# EAGLE design Syn-MainBase-v00 (EAGLE 5.10)
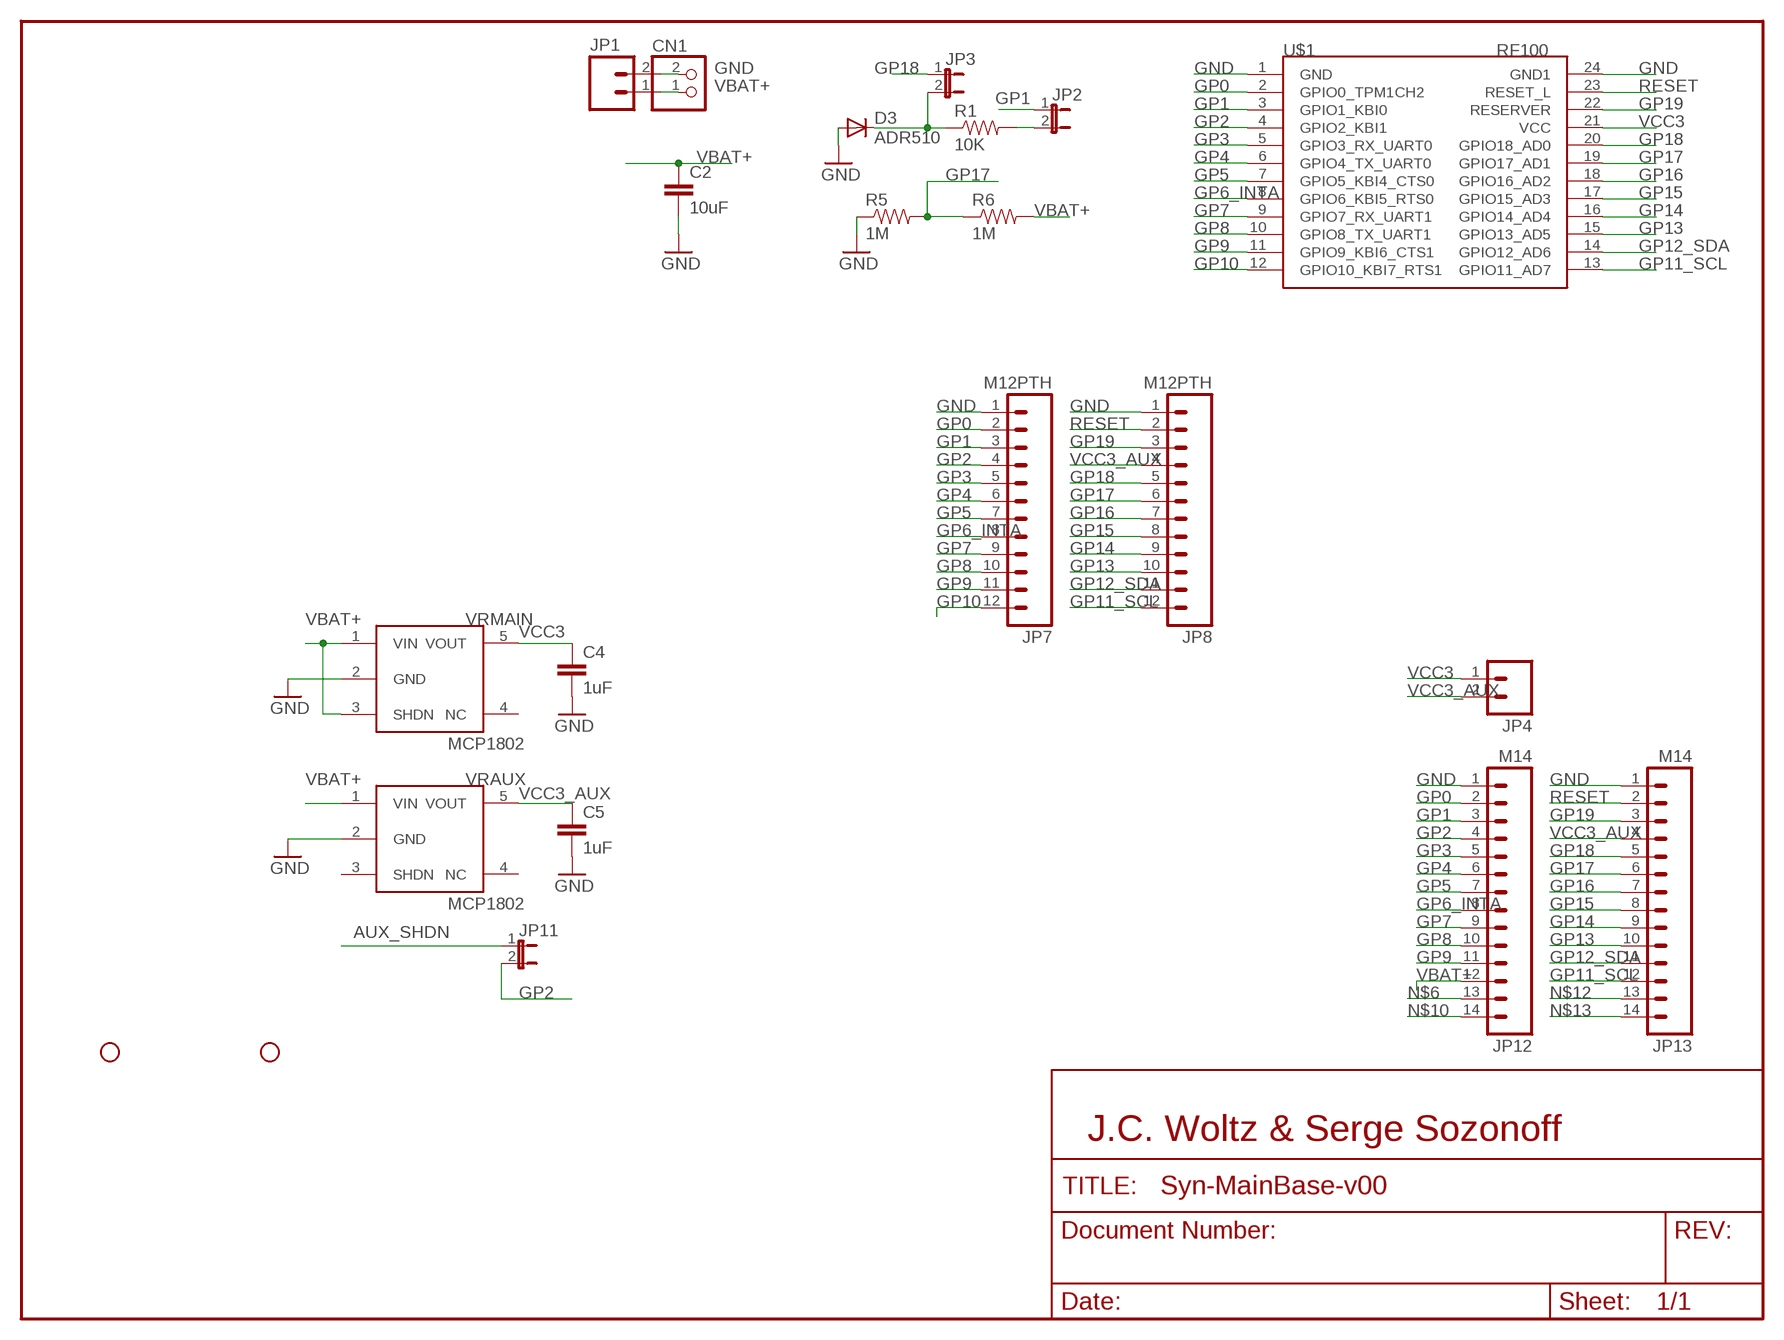
[diagram p0: schematic, sheet 1]

## Parts
C2  10uF  CAP1206  [1206]
C4  1uF  CAP0603-CAP  [0603-CAP]
C5  1uF  CAP0603-CAP  [0603-CAP]
CN1  JST_2PIN-THM-RA  [JST-PH-2-THM-RA]
D3  ADR510  DIODESOT-23-3-ADR510  [SOT23-3]
JP1  M02PTH  [1X02]
JP2  JUMPER-2SMD-NC  [SJ_2S]
JP3  JUMPER-2SMD-NC  [SJ_2S]
JP4  M02PTH  [1X02]
JP5  STAND-OFF  [STAND-OFF]
JP7  M12PTH  [1X12]
JP8  M12PTH  [1X12]
JP11  JUMPER-2SMD-NC  [SJ_2S]
JP12  M14  [1X14]
JP13  M14  [1X14]
JP17  STAND-OFF  [STAND-OFF]
R1  10K  RESISTOR0603-RES  [0603-RES]
R5  1M  RESISTOR0603-RES  [0603-RES]
R6  1M  RESISTOR0603-RES  [0603-RES]
U$1  SYNAPSEWIRELESS-RFENGINESTD  SYNAPSEWIRELESS-RFENGINETHM-SILK-TPLACE  [SYNAPSERFENGINE-THM-SILKTPLACE]
VRAUX  MCP1802  [SOT23-5]
VRMAIN  MCP1802  [SOT23-5]

## Nets
AUX_SHDN: JP11.1
GND: C2.2 C4.2 C5.2 CN1.2 D3.2(A) JP1.2 JP7.1 JP8.1 JP12.1 JP13.1 R5.1 U$1.1(GND) U$1.24(GND1) VRAUX.2(GND) VRMAIN.2(GND)
GP0: JP7.2 JP12.2 U$1.2(GPIO0_TPM1CH2)
GP1: JP2.1 JP7.3 JP12.3 U$1.3(GPIO1_KBI0)
GP2: JP7.4 JP11.2 JP12.4 U$1.4(GPIO2_KBI1)
GP3: JP7.5 JP12.5 U$1.5(GPIO3_RX_UART0)
GP4: JP7.6 JP12.6 U$1.6(GPIO4_TX_UART0)
GP5: JP7.7 JP12.7 U$1.7(GPIO5_KBI4_CTS0)
GP6_INTA: JP7.8 JP12.8 U$1.8(GPIO6_KBI5_RTS0)
GP7: JP7.9 JP12.9 U$1.9(GPIO7_RX_UART1)
GP8: JP7.10 JP12.10 U$1.10(GPIO8_TX_UART1)
GP9: JP7.11 JP12.11 U$1.11(GPIO9_KBI6_CTS1)
GP10: JP7.12 U$1.12(GPIO10_KBI7_RTS1)
GP11_SCL: JP8.12 JP13.12 U$1.13(GPIO11_AD7)
GP12_SDA: JP8.11 JP13.11 U$1.14(GPIO12_AD6)
GP13: JP8.10 JP13.10 U$1.15(GPIO13_AD5)
GP14: JP8.9 JP13.9 U$1.16(GPIO14_AD4)
GP15: JP8.8 JP13.8 U$1.17(GPIO15_AD3)
GP16: JP8.7 JP13.7 U$1.18(GPIO16_AD2)
GP17: JP8.6 JP13.6 R5.2 R6.1 U$1.19(GPIO17_AD1)
GP18: JP3.1 JP8.5 JP13.5 U$1.20(GPIO18_AD0)
GP19: JP8.3 JP13.3 U$1.22(RESERVER)
N$3: D3.1(C) JP3.2 R1.1
N$4: JP2.2 R1.2
N$6: JP12.13
N$10: JP12.14
N$12: JP13.13
N$13: JP13.14
RESET: JP8.2 JP13.2 U$1.23(RESET_L)
VBAT+: C2.1 CN1.1 JP1.1 JP12.12 R6.2 VRAUX.1(VIN) VRMAIN.1(VIN) VRMAIN.3(SHDN)
VCC3: C4.1 JP4.1 U$1.21(VCC) VRMAIN.5(VOUT)
VCC3_AUX: C5.1 JP4.2 JP8.4 JP13.4 VRAUX.5(VOUT)
Unconnected: VRAUX.3(SHDN) VRAUX.4(NC) VRMAIN.4(NC)

## Notes on the sheet
- J.C. Woltz & Serge Sozonoff

## Library data of the parts
C2 C4 C5 = SparkFun:CAP: Capacitor Standard 0603 ceramic capacitor, and 0.1" leaded capacitor.
CN1 = adafruit:JST_2PIN: JST 2-Pin Connectors of various flavors SMT-RA (S2B-PH-SM4) 4UConnector #17311 SMT (B2B-PH-SM4) THM-RA (S2B-PH) THM (B2B-PH)
D3 = 0_jc-modified:DIODE: Diode These are standard reverse protection diodes and small signal diodes. SMA package can handle up to about 1A. SOD-323 can handle about 200mA. What the SOD-323 package when ordering, there are some mfgs out there that are 5-pin packages.
JP1 JP4 = SparkFun:M02: Header 2 Standard 2-pin 0.1" header. Use with straight break away headers (SKU : PRT-00116), right angle break away headers (PRT-00553), swiss pins (PRT-00743), machine pins (PRT-00117), and female headers (PRT-00115). Molex polarized connector foot print use with SKU : PRT-08233 with associated crimp pins and housings.
JP2 JP3 JP11 = SparkFun:JUMPER-2: Jumper Basic 0.1" spaced jumper. Use with breakaway headers.
JP5 JP17 = SparkFun:STAND-OFF: Stand Off This is the mechanical footprint for a #4 phillips button head screw. Use the keepout ring to avoid running the screw head into surrounding components. SKU : PRT-00447
JP7 JP8 = SparkFun:M12: Header 12 Standard 12-pin 0.1" header. Use with straight break away headers (SKU : PRT-00116), right angle break away headers (PRT-00553), swiss pins (PRT-00743), machine pins (PRT-00117), and female headers (PRT-00115).
JP12 JP13 = SparkFun:M14: Header 14 Standard 14-pin 0.1" header. Use with straight break away headers (SKU : PRT-00116), right angle break away headers (PRT-00553), swiss pins (PRT-00743), machine pins (PRT-00117), and female headers (PRT-00115).
R1 R5 R6 = SparkFun:RESISTOR: Resistor Basic schematic elements and footprints for 0603, 1206, and PTH 1/10th watt (small) resistors.
U$1 = 0_jc-custom:SYNAPSEWIRELESS-RFENGINE
VRAUX VRMAIN = 0_jc-modified:MCP1802

## Board
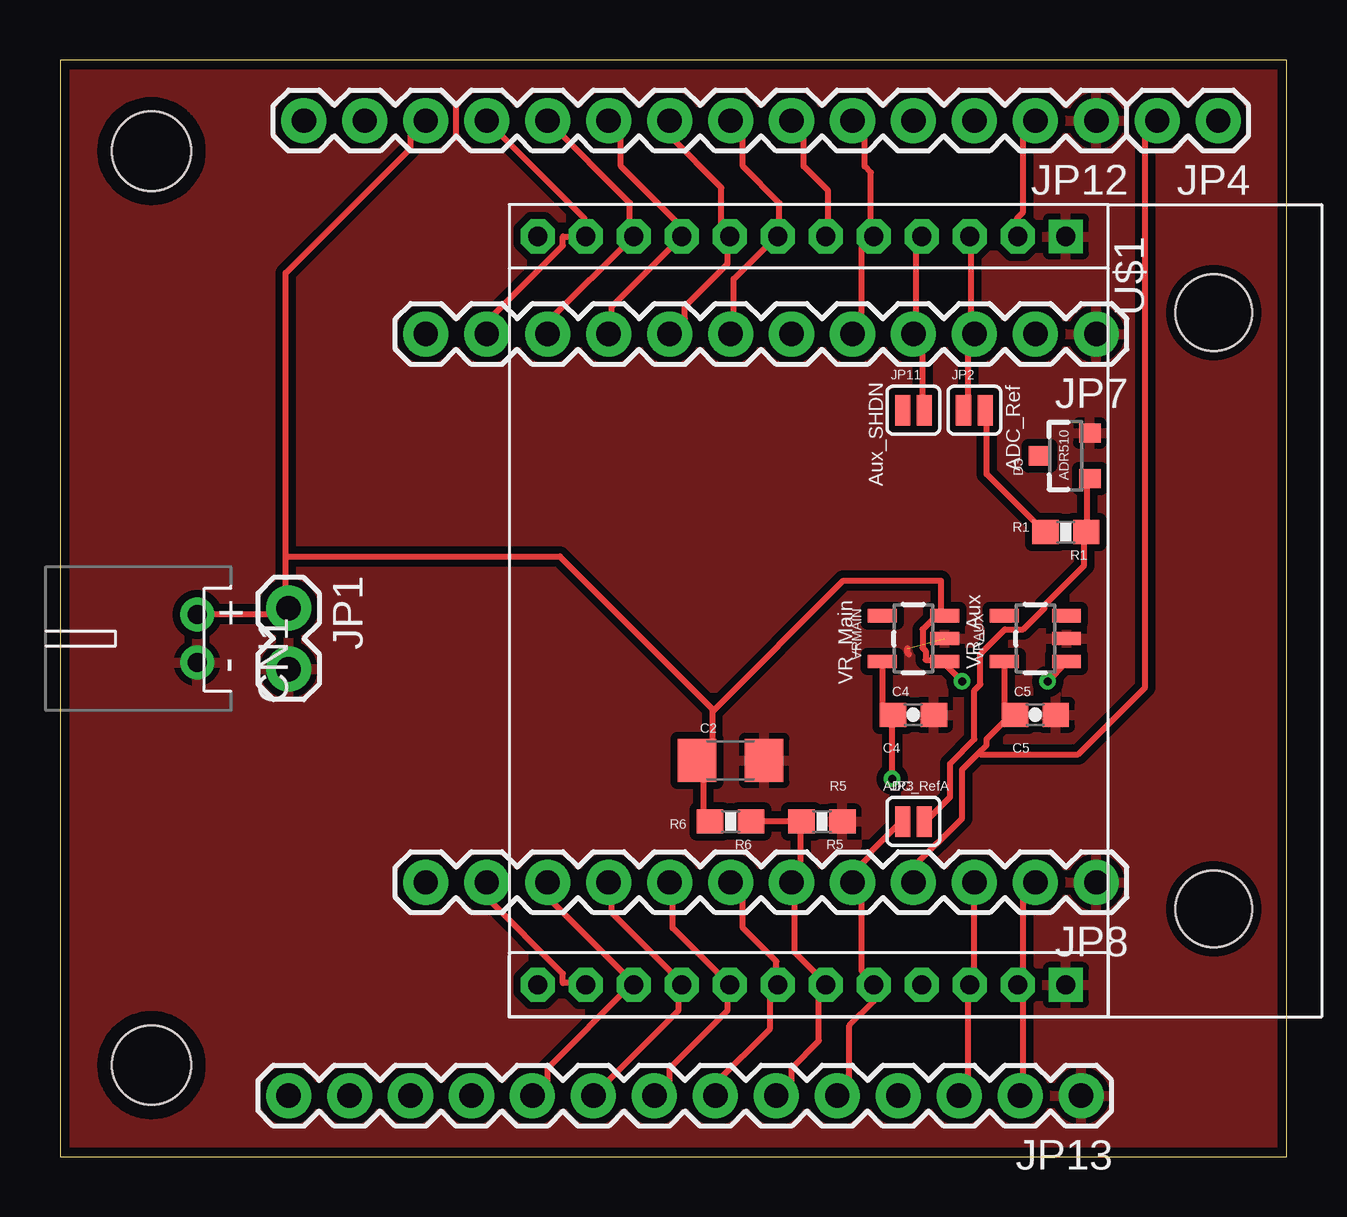
[diagram p1: board, top side]
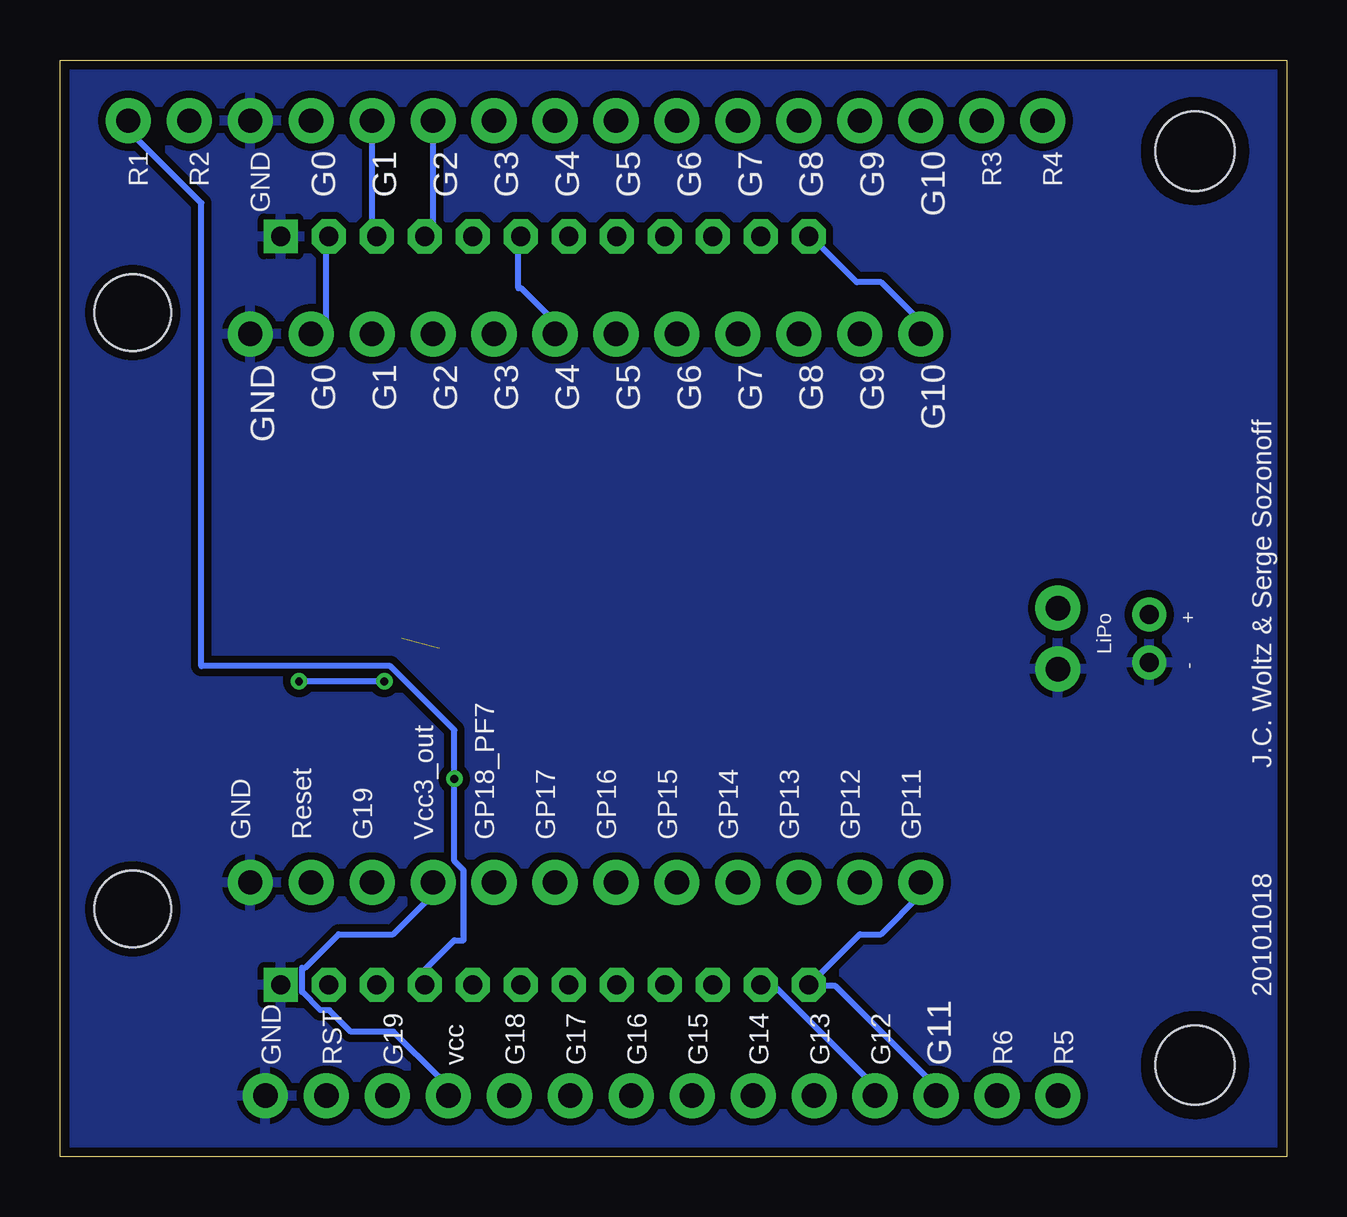
[diagram p2: board, bottom side, seen from below]

Size 51.1 x 45.71 mm. Coordinates in mm from the lower left corner, seen from the top.
Outline: 0,0 51.1,0 51.1,45.71 0,45.71 0,0
Copper layers (1*16): Top 0.0356mm / dielectric 1.5011mm / Bottom 0.0356mm
Design rules "LaenPCBOrder-JCModified": minimum track width 10mil, minimum drill 13mil, track to track 10mil, track to pad 6mil, pad to pad 6mil, via to via 6mil, smd to smd 6mil, copper to edge 15mil, drill to drill 6mil, minimum pad ring 12mil, minimum via ring 7mil, stop-mask expansion 4mil, vias tented up to drill 25mil, thermal gap 10mil

### Footprints (pad centres in the part's own frame; a part is rotated, then mirrored left to right if it is on the bottom)
1206 = smd 1.6 x 1.8: 1 -1.4,0; 2 1.4,0
0603-CAP = smd 1.1 x 1: 1 -0.85,0; 2 0.85,0
JST-PH-2-THM-RA = drill 0.8 pad 1.422 round: 1 1,0; 2 -1,0
SOT23-3 = smd 0.8 x 0.9: 1 -0.95,-1; 2 0.95,-1; 3 0,1.1
1X02 = drill 1.016 pad 1.88 round: 1 0,0; 2 2.54,0
SJ_2S = smd 0.635 x 1.27: 1 -0.45,0; 2 0.45,0
STAND-OFF = hole 3.302: 0,0
1X12 = drill 1.016 pad 1.88 round: 1 0,0; 2 2.54,0; 3 5.08,0; 4 7.62,0; 5 10.16,0; 6 12.7,0; 7 15.24,0; 8 17.78,0; 9 20.32,0; 10 22.86,0; 11 25.4,0; 12 27.94,0
1X14 = drill 1.016 pad 1.88 round: 1 0,0; 2 2.54,0; 3 5.08,0; 4 7.62,0; 5 10.16,0; 6 12.7,0; 7 15.24,0; 8 17.78,0; 9 20.32,0; 10 22.86,0; 11 25.4,0; 12 27.94,0; 13 30.48,0; 14 33.02,0
0603-RES = smd 1.1 x 1: 1 -0.85,0; 2 0.85,0
SYNAPSERFENGINE-THM-SILKTPLACE = drill 0.8 square: 1 0,0; 24 31.2,0 | drill 0.8 pad 1.422 octagon: 2 0,-2; 3 0,-4; 4 0,-6; 5 0,-8; 6 0,-10; 7 0,-12; 8 0,-14; 9 0,-16; 10 0,-18; 11 0,-20; 12 0,-22; 13 31.2,-22; 14 31.2,-20; 15 31.2,-18; 16 31.2,-16; 17 31.2,-14; 18 31.2,-12; 19 31.2,-10; 20 31.2,-8; 21 31.2,-6; 22 31.2,-4; 23 31.2,-2 | hole 3.2: 3.17,6.16; 28.03,6.16
SOT23-5 = smd 0.55 x 1.2: 1 -0.95,-1.3; 2 0,-1.3; 3 0.95,-1.3; 4 0.95,1.3; 5 -0.95,1.3

### Placement (x,y rotation side)
C2  27.94,16.51 0 top
C4  35.56,18.41 0 top
C5  40.64,18.41 0 top
CN1  5.71,21.59 90 top
D3  41.91,29.21 90 top
JP1  9.53,22.86 270 top
JP2  38.1,31.11 0 top
JP3  35.56,13.97 0 top
JP4  48.26,43.18 180 top
JP5  3.81,41.91 0 top
JP7  43.18,34.29 180 top
JP8  43.18,11.43 180 top
JP11  35.56,31.11 0 top
JP12  43.18,43.18 180 top
JP13  42.55,2.54 180 top
JP17  3.81,3.81 0 top
R1  41.91,26.04 180 top
R5  31.75,13.97 180 top
R6  27.94,13.97 180 top
U$1  41.91,38.35 270 top
VRAUX  40.64,21.59 90 top
VRMAIN  35.56,21.59 90 top

### Tracks (layer width: path | path; a pad name or v marks a point on that pad's centre or on a via)
GND  (1 unrouted)
  Top 0.254: 35.31,21.19 35.31,21.08 35.37,20.93 | 16.51,42.46 16.51,43.9
  pour Bottom (isolate 0.305): 0,45.72 50.8,45.72 50.8,0 0,0
  pour Top (isolate 0.305): 0,45.72 50.8,45.72 50.8,0 0,0
GP0
  Top 0.254: JP12.2 40.13,42.67 40.13,39.37 39.88,39.12 39.88,38.35 U$1.2
  Bottom 0.254: JP7.2 40.01,34.29 40.01,38.35 U$1.2
GP1
  Top 0.254: JP2.1 37.72,31.11 37.85,31.24 37.85,34.04 JP7.3 37.97,34.29 37.97,38.35 U$1.3
  Bottom 0.254: JP12.3 38.1,38.35 U$1.3
GP2
  Top 0.254: JP11.2 35.94,31.11 35.94,33.4 35.56,33.78 JP7.4 35.69,33.78 35.69,38.23 35.81,38.35 U$1.4
  Bottom 0.254: JP12.4 35.56,38.35 U$1.4
GP3
  Top 0.254: JP7.5 33.02,34.8 33.4,35.18 33.4,37.85 U$1.5 33.78,38.35 33.78,41.02 33.53,41.27 33.53,42.67 JP12.5
GP4
  Top 0.254: JP12.6 30.99,42.67 30.99,41.27 32,40.26 32,38.35 U$1.6
  Bottom 0.254: JP7.6 30.48,34.8 31.88,36.2 32,36.2 32,38.35 U$1.6
GP5
  Top 0.254: JP7.7 28.07,34.42 28.07,36.58 29.84,38.35 U$1.7 29.97,38.35 29.97,39.75 28.45,41.27 28.45,42.67 JP12.7
GP6_INTA
  Top 0.254: 27.81,38.35 27.56,38.61 27.56,40.39 25.4,42.55 JP12.8 | JP7.8 26.04,34.92 26.04,35.43 27.81,37.21 27.81,38.35 | 27.81,38.35 U$1.8
GP7
  Top 0.254: JP7.9 22.99,34.42 22.99,35.43 U$1.9 25.78,38.35 25.78,38.86 23.37,41.27 23.37,42.67 JP12.9
GP8
  Top 0.254: JP7.10 20.32,34.8 23.88,38.35 U$1.10 23.75,38.35 23.75,39.75 JP12.10
GP9
  Top 0.254: 21.84,38.35 20.95,38.35 20.95,37.97 17.78,34.8 JP7.11 | JP12.11 21.84,39.12 21.84,38.35 | 21.84,38.35 U$1.11
GP10
  Bottom 0.254: JP7.12 15.24,34.8 16.89,36.45 17.91,36.45 19.81,38.35 U$1.12
GP11_SCL
  Bottom 0.254: JP8.12 15.24,10.92 16.89,9.27 17.78,9.27 19.81,7.24 U$1.13 19.81,7.11 18.8,7.11 14.99,3.3 14.61,3.3 JP13.12
GP12_SDA
  Top 0.254: JP8.11 17.78,10.79 20.95,7.62 20.95,7.24 21.84,7.24 U$1.14
  Bottom 0.254: JP13.11 17.14,3.3 17.53,3.3 21.34,7.11 21.84,7.11 U$1.14
GP13
  Top 0.254: JP8.10 20.32,10.79 23.88,7.24 U$1.15 23.75,7.24 23.75,7.11 20.32,3.68 20.32,3.17 JP13.10
GP14
  Top 0.254: JP8.9 22.99,11.3 22.99,10.16 25.91,7.24 U$1.16 25.78,7.24 25.78,6.1 JP13.9
GP15
  Top 0.254: JP8.8 25.53,11.3 25.53,9.53 27.81,7.24 U$1.17 27.81,7.11 27.81,6.1 25.4,3.68 25.4,3.17 JP13.8
GP16
  Top 0.254: JP13.7 27.3,3.05 29.59,5.33 29.59,6.86 29.84,7.11 U$1.18 29.84,7.24 29.84,8.13 28.45,9.53 28.45,10.92 JP8.7
GP17
  Top 0.254: 30.86,13.97 R6.1 | 30.86,13.97 30.86,12.32 30.48,11.94 JP8.6 30.61,11.94 30.61,8.51 31.88,7.24 U$1.19 31.62,7.37 31.62,4.83 30.48,3.68 30.48,3.17 JP13.6 | 30.86,13.97 R5.2
GP18
  Top 0.254: JP3.1 35.05,13.97 33.78,12.7 33.78,12.57 33.02,11.81 JP8.5 33.4,12.06 33.4,7.75 33.91,7.24 U$1.20 33.91,7.11 33.91,6.48 32.89,5.46 32.89,3.05 JP13.5
GP19
  Top 0.254: JP8.3 38.1,7.37 37.97,7.24 U$1.22 37.85,7.11 37.85,2.92 JP13.3
N$3
  Top 0.254: D3.1 42.8,28.19 42.8,26.04 R1.1 42.67,26.04 42.67,24.64 41.02,22.99 41.02,22.86 40.13,21.97 39.37,21.97 38.35,20.95 38.35,19.68 38.1,19.43 38.1,17.4 37.08,16.38 37.08,14.99 36.07,13.97 JP3.2
N$4
  Top 0.254: R1.2 41.02,26.04 38.61,28.45 38.61,31.11 JP2.2
RESET
  Top 0.254: JP13.2 40.13,2.67 40.13,6.99 40.01,7.11 U$1.23 40.13,7.11 40.13,10.92 JP8.2
VBAT+  (via drill 0.33)
  Top 0.254: R6.2 27.05,13.97 26.8,14.22 26.8,16.26 C2.1 26.67,16.51 27.18,17.02 27.18,18.54 27.24,18.61 | 36.7,22.48 36.83,22.48 VRMAIN.3 36.7,22.48 | 36.7,22.48 36.45,22.48 35.94,21.97 35.94,21.21 36.07,21.08 36.07,20.7 36.83,20.7 VRMAIN.1 36.96,20.57 36.96,20.45 v37.59,19.81 | v41.15,19.81 41.91,20.57 VRAUX.1 | 27.24,18.61 32.64,24 36.7,24 36.7,22.48 | 9.4,22.61 9.53,22.61 JP1.1 9.4,22.61 | 9.4,22.61 5.71,22.61 CN1.1 | JP12.12 14.61,42.55 14.61,42.04 9.4,36.83 9.4,25.02 | 9.4,22.61 9.4,25.02 | 9.4,25.02 20.83,25.02 27.24,18.61
  Bottom 0.254: v37.59,19.81 v41.15,19.81
VCC3  (via drill 0.33)
  Top 0.254: 34.67,18.41 34.29,18.8 34.29,20.57 VRMAIN.5 | v34.67,15.75 34.67,18.41 | 34.67,18.41 C4.1
  Bottom 0.254: U$1.21 35.94,7.24 35.94,7.75 34.67,9.02 34.29,9.02 34.29,11.94 34.67,12.32 v34.67,15.75 34.67,17.78 37.34,20.45 45.21,20.45 45.21,39.75 47.88,42.42 48.26,42.42 JP4.1
VCC3_AUX
  Top 0.254: VRAUX.5 39.37,20.57 39.37,18.8 39.75,18.41 C5.1 39.62,18.41 38.61,17.4 38.61,17.14 38.29,16.83 | 38.29,16.83 37.59,16.13 37.59,14.1 35.56,12.06 JP8.4 | JP4.2 45.21,42.67 45.21,19.56 42.42,16.76 38.35,16.76 38.29,16.83
  Bottom 0.254: JP13.4 34.92,3.3 35.31,3.3 37.21,5.21 38.99,5.21 39.88,6.1 40.26,6.1 41.02,6.86 41.02,7.87 40.89,7.87 39.5,9.27 37.21,9.27 35.56,10.92 JP8.4

### Text on the board
tPlace: ADC_Ref | Aux_SHDN | ADR510 | R1 | VR_Main | VR_Aux | C4 | C5 | R5 | ADC_RefA | R6
bPlace: R4 | R3 | G10 | G9 | G8 | G7 | G6 | G5 | G4 | G3 | G2 | G1 | G0 | GND | R2 | R1 | G10 | G9 | G8 | G7 | G6 | G5 | G4 | G3 | G2 | G1 | G0 | GND | + | LiPo | - | J.C. Woltz & Serge Sozonoff | GP11 | GP12 | GP13 | GP14 | GP15 | GP16 | GP17 | GP18_PF7 | Vcc3_out | G19 | Reset | GND | 20101018 | R5 | R6 | G11 | G12 | G13 | G14 | G15 | G16 | G17 | G18 | vcc | G19 | RST | GND